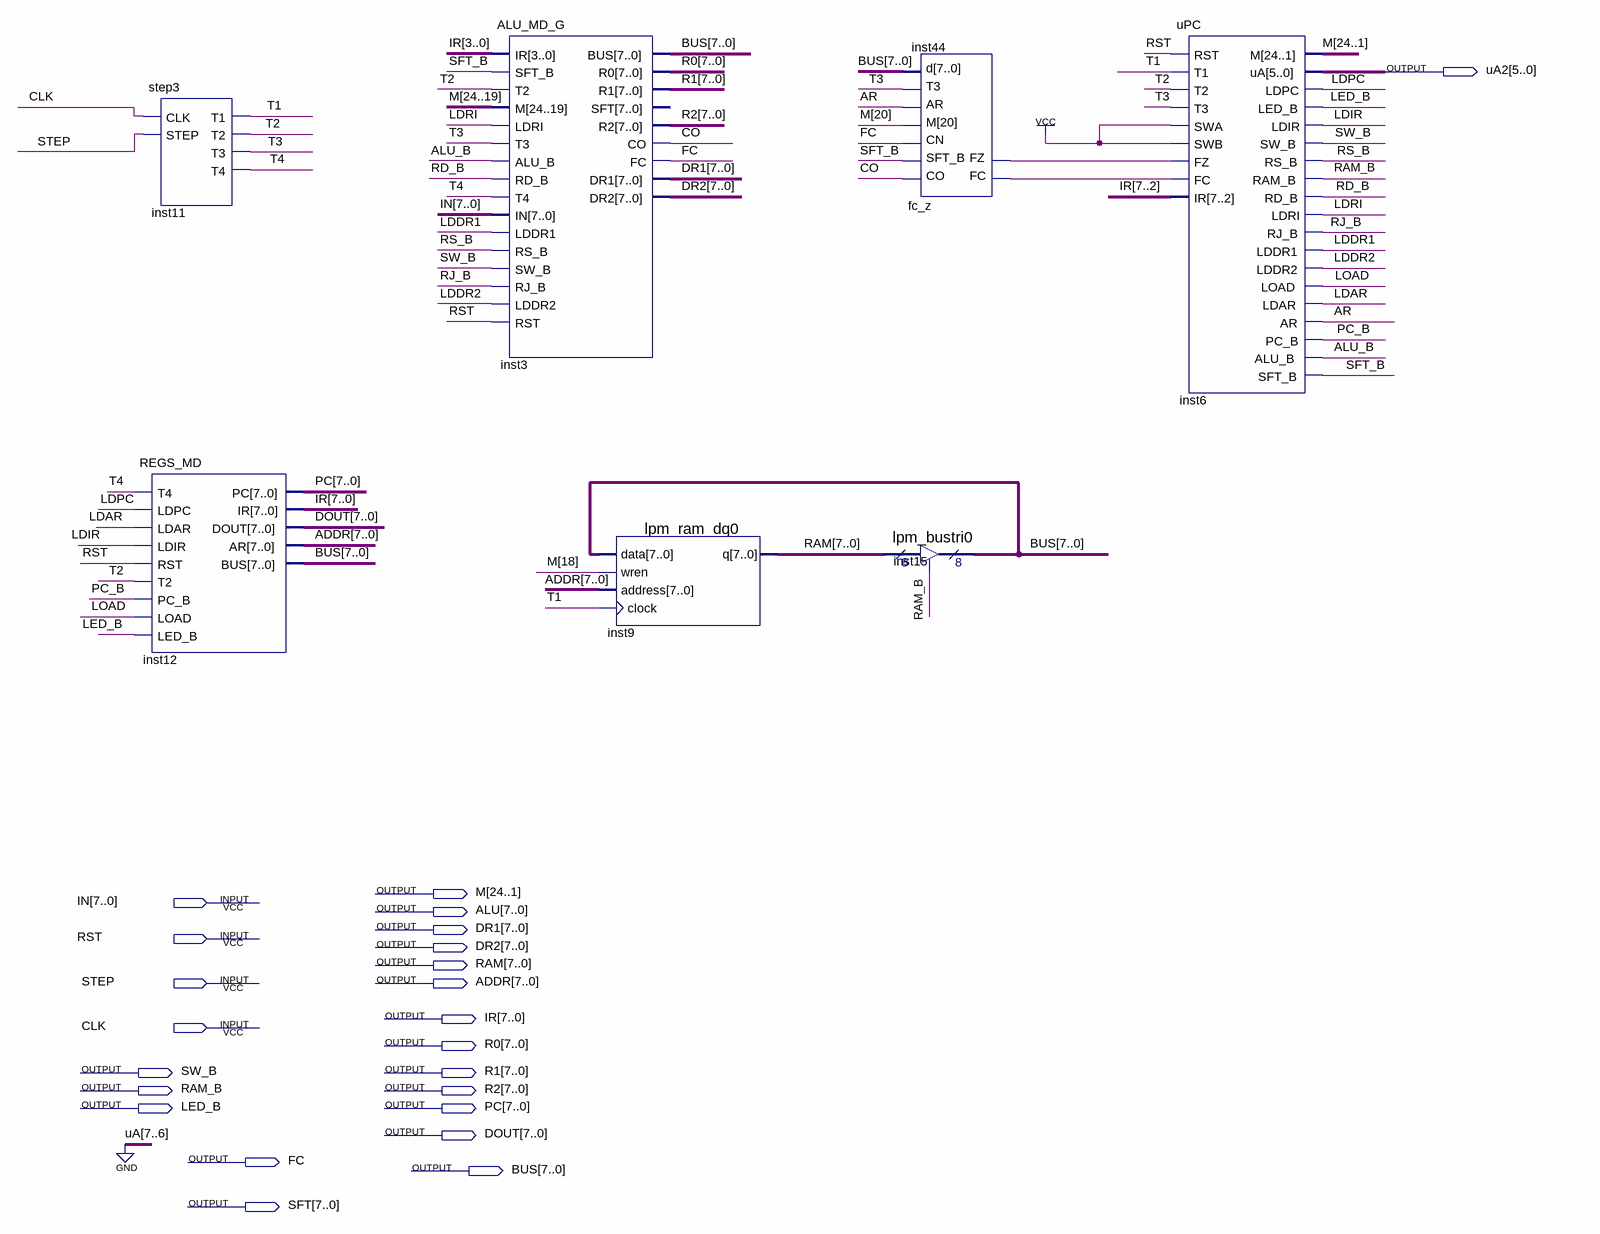
[diagram p0: schematic sheet]
// Quartus schematic CPU_TOP.bdf as structural Verilog: 7 symbols, 23 pins
module CPU_TOP (
  input  [7:0] IN,
  input  RST,
  input  STEP,
  input  CLK,
  output [5:0] uA2,
  output [24:1] M,
  output [7:0] ALU,
  output [7:0] DR1,
  output [7:0] DR2,
  output [7:0] RAM,
  output [7:0] ADDR,
  output [7:0] IR,
  output [7:0] R0,
  output SW_B,
  output [7:0] R1,
  output RAM_B,
  output [7:0] R2,
  output LED_B,
  output [7:0] PC,
  output [7:0] DOUT,
  output FC,
  output [7:0] BUS,
  output [7:0] SFT
);

  wire ALU_B, AR, CO, inst44_fc, inst44_fz, LDAR, LDDR1, LDDR2, LDIR, LDPC, LDRI, LOAD, PC_B, RD_B, RJ_B,
       RS_B, SFT_B, T1, T2, T3, T4;

  step3 inst11 (.CLK(CLK), .STEP(STEP), .T1(T1), .T2(T2), .T3(T3), .T4(T4));
  REGS_MD inst12 (
    .T4(T4), .LDPC(LDPC), .LDAR(LDAR), .LDIR(LDIR), .RST(RST), .T2(T2), .PC_B(PC_B), .LOAD(LOAD),
    .LED_B(LED_B), .PC(PC), .IR(IR), .DOUT(DOUT), .AR(ADDR), .BUS(BUS));
  ALU_MD_G inst3 (
    .IR(IR[3:0]), .SFT_B(SFT_B), .T2(T2), .M(M[24:19]), .LDRI(LDRI), .T3(T3), .ALU_B(ALU_B), .RD_B(RD_B),
    .T4(T4), .IN(IN), .LDDR1(LDDR1), .RS_B(RS_B), .SW_B(SW_B), .RJ_B(RJ_B), .LDDR2(LDDR2), .RST(RST),
    .R0(R0), .R1(R1), .R2(R2), .CO(CO), .FC(FC), .DR1(DR1), .DR2(DR2), .BUS(BUS));  // open: SFT
  lpm_ram_dq0 inst9 (.data(BUS), .wren(M[18]), .address(ADDR), .clock(T1), .q(RAM));
  fc_z inst44 (.CO(CO), .SFT_B(SFT_B), .CN(FC), .M(M[20]), .AR(AR), .T3(T3), .d(BUS), .FC(inst44_fc), .FZ(inst44_fz));
  lpm_bustri0 inst15 (.enabledt(RAM_B), .data(RAM), .tridata(BUS));
  uPC inst6 (
    .RST(RST), .T1(T1), .T2(T2), .T3(T3), .SWA(1'b1), .SWB(1'b1), .FZ(inst44_fz), .FC(inst44_fc),
    .IR(IR[7:2]), .M(M), .uA(uA2), .LDPC(LDPC), .LED_B(LED_B), .LDIR(LDIR), .SW_B(SW_B), .RS_B(RS_B),
    .RAM_B(RAM_B), .RD_B(RD_B), .LDRI(LDRI), .RJ_B(RJ_B), .LDDR1(LDDR1), .LDDR2(LDDR2), .LOAD(LOAD),
    .LDAR(LDAR), .AR(AR), .PC_B(PC_B), .ALU_B(ALU_B), .SFT_B(SFT_B));
endmodule
